# EAGLE schematic FlowController (EAGLE 9.6.2)
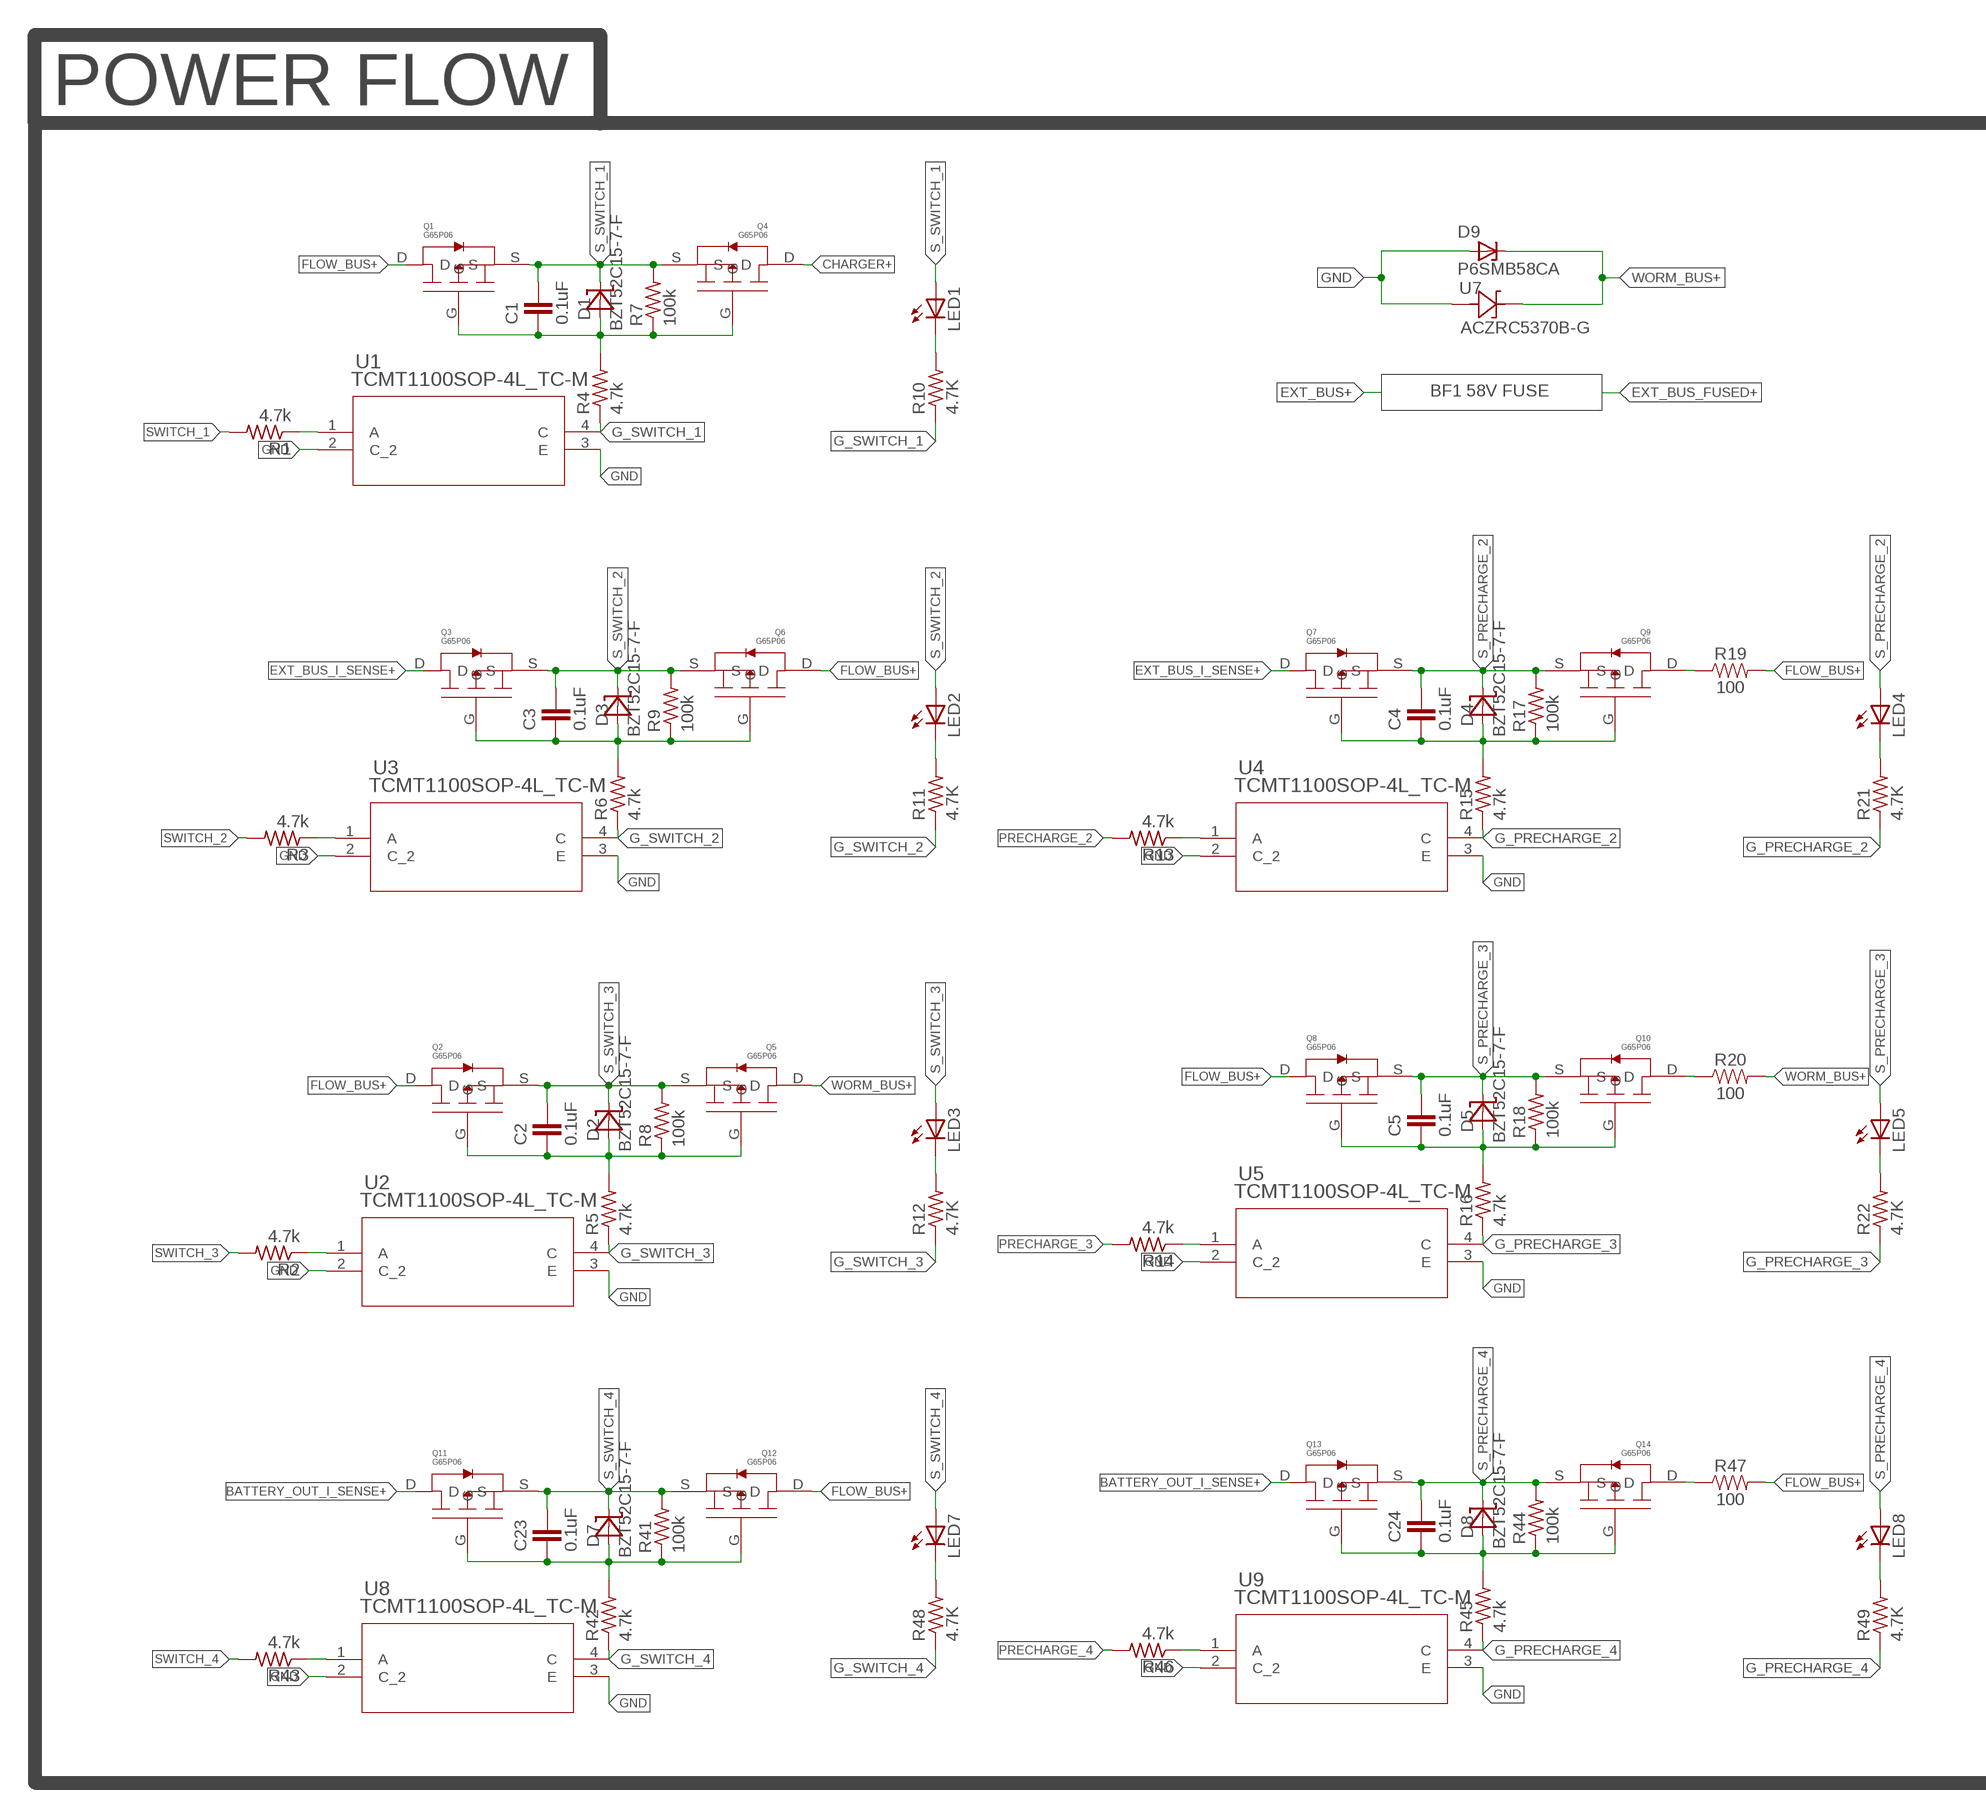
[diagram p0: schematic, sheet 1, part 1 of 2]
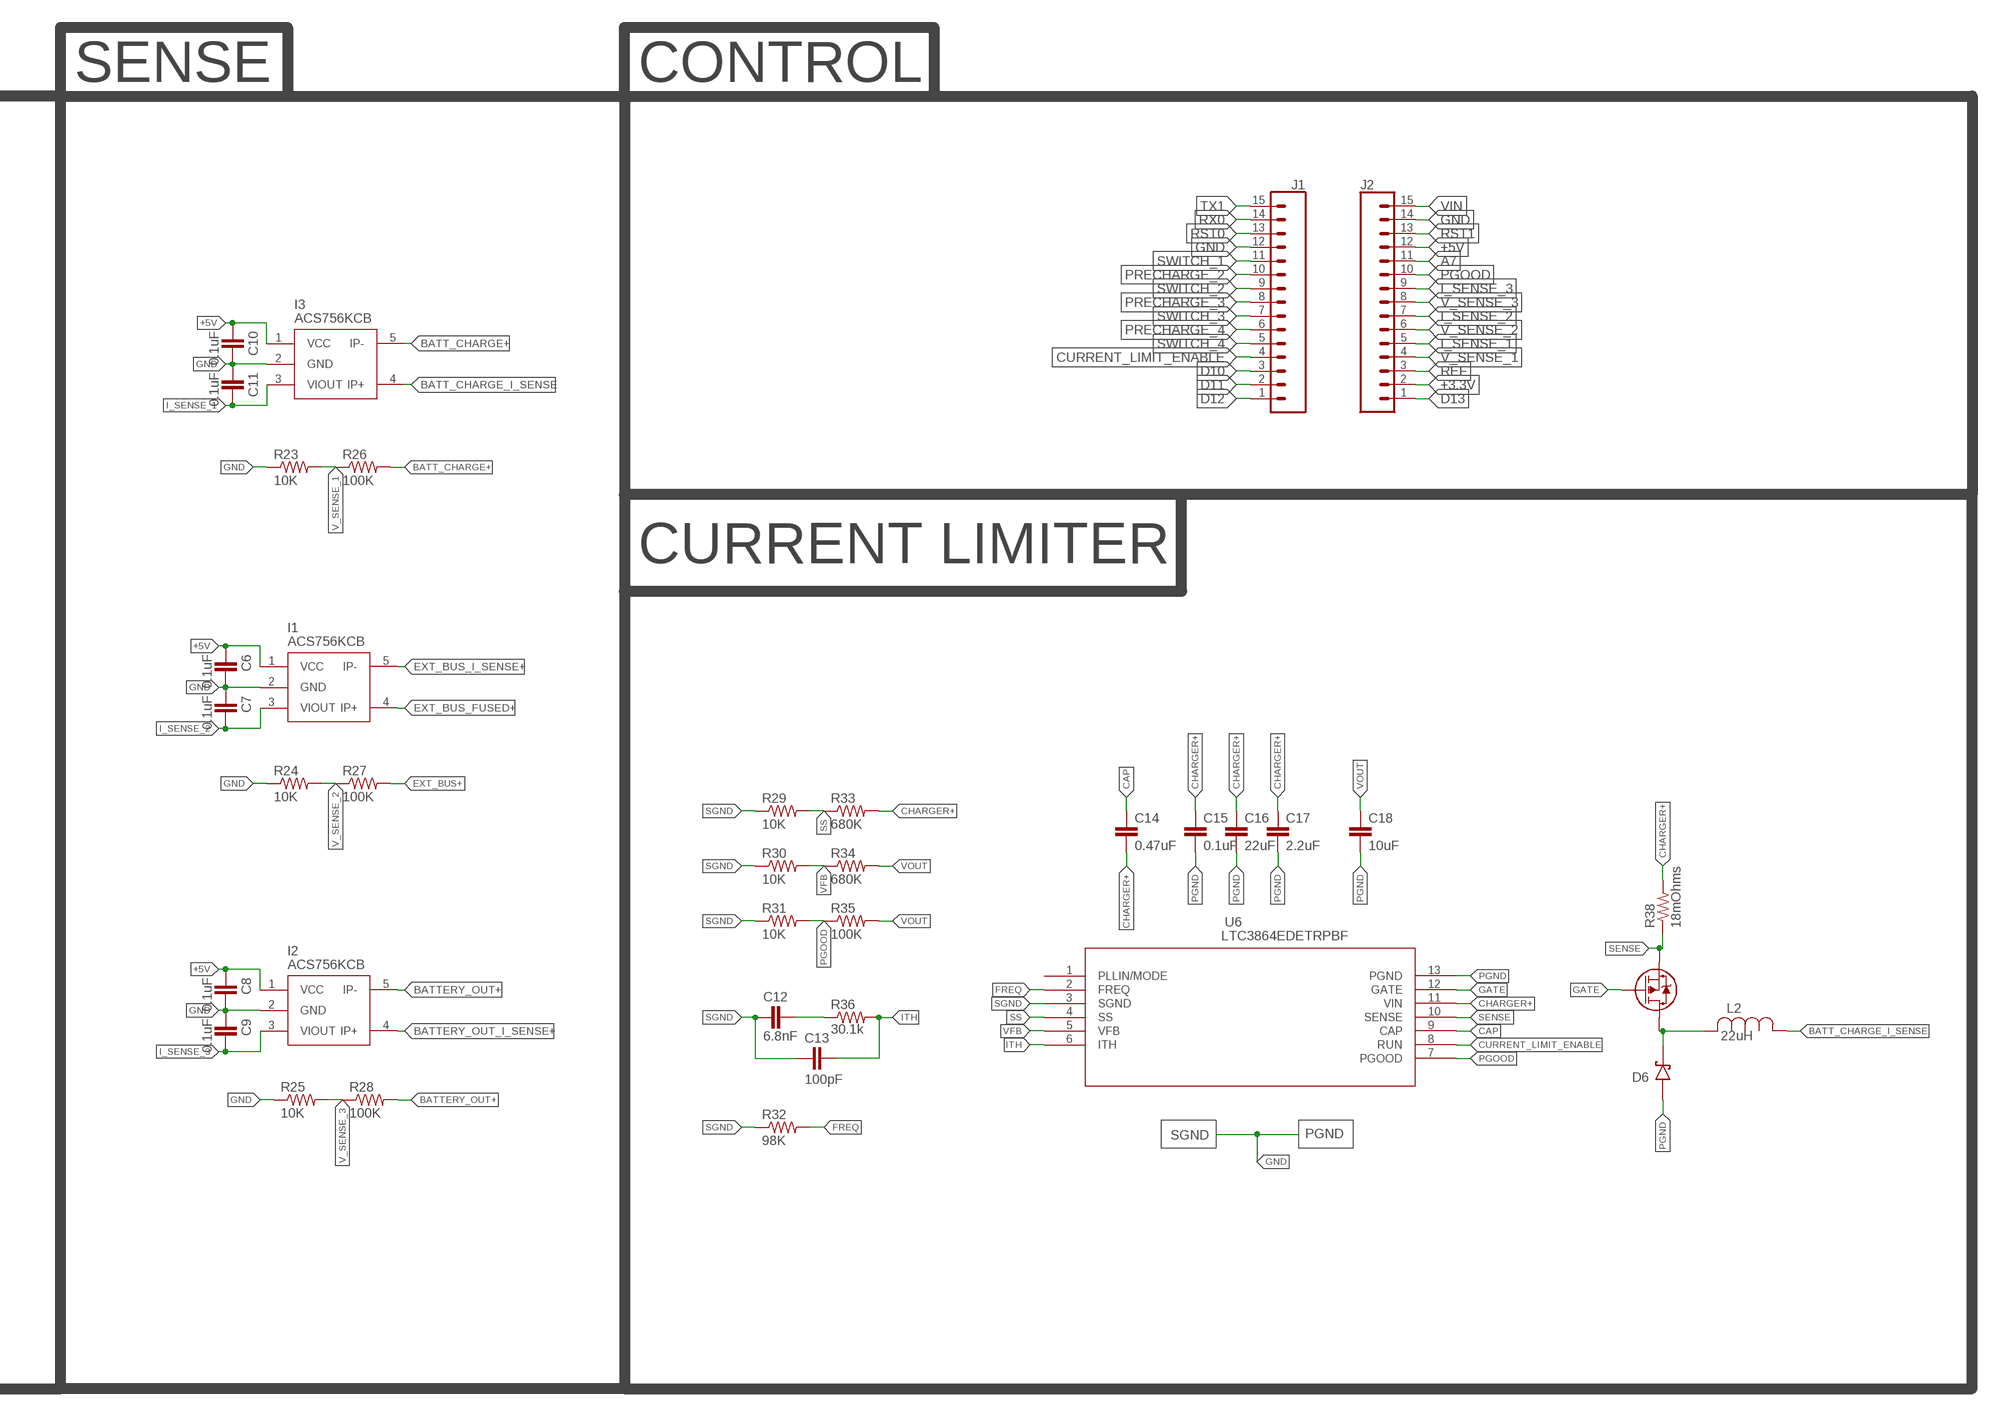
[diagram p1: schematic, sheet 1, part 2 of 2]

## Parts
C1  0.1uF  2.2UF-0805-25V-(+80/-20%)  [0805]
C2  0.1uF  2.2UF-0805-25V-(+80/-20%)  [0805]
C3  0.1uF  2.2UF-0805-25V-(+80/-20%)  [0805]
C4  0.1uF  2.2UF-0805-25V-(+80/-20%)  [0805]
C5  0.1uF  2.2UF-0805-25V-(+80/-20%)  [0805]
C6  0.1uF  2.2UF-0805-25V-(+80/-20%)  [0805]
C7  0.1uF  2.2UF-0805-25V-(+80/-20%)  [0805]
C8  0.1uF  2.2UF-0805-25V-(+80/-20%)  [0805]
C9  0.1uF  2.2UF-0805-25V-(+80/-20%)  [0805]
C10  0.1uF  2.2UF-0805-25V-(+80/-20%)  [0805]
C11  0.1uF  2.2UF-0805-25V-(+80/-20%)  [0805]
C12  6.8nF  2.2UF-0805-25V-(+80/-20%)  [0805]
C13  100pF  2.2UF-0805-25V-(+80/-20%)  [0805]
C14  0.47uF  2.2UF-0805-25V-(+80/-20%)  [0805]
C15  0.1uF  2.2UF-0805-25V-(+80/-20%)  [0805]
C16  22uF  10UF-1210-50V-20%  [1210]
C17  2.2uF  10UF-1210-50V-20%  [1210]
C18  10uF  10UF-1210-50V-20%  [1210]
C23  0.1uF  2.2UF-0805-25V-(+80/-20%)  [0805]
C24  0.1uF  2.2UF-0805-25V-(+80/-20%)  [0805]
D1  BZT52C15-7-F  [SOD123]
D2  BZT52C15-7-F  [SOD123]
D3  BZT52C15-7-F  [SOD123]
D4  BZT52C15-7-F  [SOD123]
D5  BZT52C15-7-F  [SOD123]
D6  MBR1560STR  [DIO_MBR1560STR]
D7  BZT52C15-7-F  [SOD123]
D8  BZT52C15-7-F  [SOD123]
D9  P6SMB58CA  1SMB5913BT3G  [DO214AA]
I1  ACS756KCB  [ACS756KCB]
I2  ACS756KCB  [ACS756KCB]
I3  ACS756KCB  [ACS756KCB]
J1  CONN_15  [1X15]
J2  CONN_15  [1X15]
L2  22uH  IHLP4040DZER6R8M01  [IND_IHLP-4040DZ_VIS]
LED1  LEDCHIPLED_0805  [CHIPLED_0805]
LED2  LEDCHIPLED_0805  [CHIPLED_0805]
LED3  LEDCHIPLED_0805  [CHIPLED_0805]
LED4  LEDCHIPLED_0805  [CHIPLED_0805]
LED5  LEDCHIPLED_0805  [CHIPLED_0805]
LED7  LEDCHIPLED_0805  [CHIPLED_0805]
LED8  LEDCHIPLED_0805  [CHIPLED_0805]
Q1  G65P06  [G65P06]
Q2  G65P06  [G65P06]
Q3  G65P06  [G65P06]
Q4  G65P06  [G65P06]
Q5  G65P06  [G65P06]
Q6  G65P06  [G65P06]
Q7  G65P06  [G65P06]
Q8  G65P06  [G65P06]
Q9  G65P06  [G65P06]
Q10  G65P06  [G65P06]
Q11  G65P06  [G65P06]
Q12  G65P06  [G65P06]
Q13  G65P06  [G65P06]
Q14  G65P06  [G65P06]
R1  4.7k  R-US_M0805  [M0805]
R2  4.7k  R-US_M0805  [M0805]
R3  4.7k  R-US_M0805  [M0805]
R4  4.7k  R-US_M0805  [M0805]
R5  4.7k  R-US_M0805  [M0805]
R6  4.7k  R-US_M0805  [M0805]
R7  100k  R-US_M0805  [M0805]
R8  100k  R-US_M0805  [M0805]
R9  100k  R-US_M0805  [M0805]
R10  4.7K  R-US_M0805  [M0805]
R11  4.7K  R-US_M0805  [M0805]
R12  4.7K  R-US_M0805  [M0805]
R13  4.7k  R-US_M0805  [M0805]
R14  4.7k  R-US_M0805  [M0805]
R15  4.7k  R-US_M0805  [M0805]
R16  4.7k  R-US_M0805  [M0805]
R17  100k  R-US_M0805  [M0805]
R18  100k  R-US_M0805  [M0805]
R19  100  0.05OHM-2512-3W-1%  [2512]
R20  100  0.05OHM-2512-3W-1%  [2512]
R21  4.7K  R-US_M0805  [M0805]
R22  4.7K  R-US_M0805  [M0805]
R23  10K  R-US_M0805  [M0805]
R24  10K  R-US_M0805  [M0805]
R25  10K  R-US_M0805  [M0805]
R26  100K  R-US_M0805  [M0805]
R27  100K  R-US_M0805  [M0805]
R28  100K  R-US_M0805  [M0805]
R29  10K  R-US_M0805  [M0805]
R30  10K  R-US_M0805  [M0805]
R31  10K  R-US_M0805  [M0805]
R32  98K  R-US_M0805  [M0805]
R33  680K  R-US_M0805  [M0805]
R34  680K  R-US_M0805  [M0805]
R35  100K  R-US_M0805  [M0805]
R36  30.1k  R-US_M0805  [M0805]
R37  RSJ250P10TL  [TRANS_R5009FNJ_ROM]
R38  18mOhms  R-US_M0805  [M0805]
R41  100k  R-US_M0805  [M0805]
R42  4.7k  R-US_M0805  [M0805]
R43  4.7k  R-US_M0805  [M0805]
R44  100k  R-US_M0805  [M0805]
R45  4.7k  R-US_M0805  [M0805]
R46  4.7k  R-US_M0805  [M0805]
R47  100  0.05OHM-2512-3W-1%  [2512]
R48  4.7K  R-US_M0805  [M0805]
R49  4.7K  R-US_M0805  [M0805]
U1  TCMT1100SOP-4L_TC-M  [SOP-4L_TC-M]
U2  TCMT1100SOP-4L_TC-M  [SOP-4L_TC-M]
U3  TCMT1100SOP-4L_TC-M  [SOP-4L_TC-M]
U4  TCMT1100SOP-4L_TC-M  [SOP-4L_TC-M]
U5  TCMT1100SOP-4L_TC-M  [SOP-4L_TC-M]
U6  LTC3864EDETRPBF  [DFN-12_DE]
U7  ACZRC5370B-G  [ACZRC-G]
U8  TCMT1100SOP-4L_TC-M  [SOP-4L_TC-M]
U9  TCMT1100SOP-4L_TC-M  [SOP-4L_TC-M]

## Nets
+3.3V: J2.2
+5V: C6.1 C8.1 C10.1 I1.1(VCC) I2.1(VCC) I3.1(VCC) J2.12
A7: J2.11
BATT_CHARGE+: I3.5(IP-) R26.2
BATT_CHARGE_I_SENSE: I3.4(IP+) L2.1
BATTERY_OUT+: I2.5(IP-) R28.2
BATTERY_OUT_I_SENSE+: I2.4(IP+) Q11.D Q13.D
CAP: C14.1 U6.9(CAP)
CHARGER+: C14.2 C15.1 C16.1 C17.1 Q4.D R33.2 R38.2 U6.11(VIN)
CURRENT_LIMIT_ENABLE: J1.4 U6.8(RUN)
D10: J1.3
D11: J1.2
D12: J1.1
D13: J2.1
EXT_BUS+: R27.2
EXT_BUS_FUSED+: I1.4(IP+)
EXT_BUS_I_SENSE+: I1.5(IP-) Q3.D Q7.D
FLOW_BUS+: Q1.D Q2.D Q6.D Q8.D Q12.D R19.P$2 R47.P$2
FREQ: R32.2 U6.2(FREQ)
G_PRECHARGE_2: R15.1 R21.1 U4.4(C)
G_PRECHARGE_3: R16.1 R22.1 U5.4(C)
G_PRECHARGE_4: R45.1 R49.1 U9.4(C)
G_SWITCH_1: R4.1 R10.1 U1.4(C)
G_SWITCH_2: R6.1 R11.1 U3.4(C)
G_SWITCH_3: R5.1 R12.1 U2.4(C)
G_SWITCH_4: R42.1 R48.1 U8.4(C)
GATE: R37.1 U6.12(GATE)
GND: C6.2 C7.1 C8.2 C9.1 C10.2 C11.1 D9.A I1.2(GND) I2.2(GND) I3.2(GND) J1.12 J2.14 R23.1 R24.1 R25.1 U1.2(C_2) U1.3(E) U2.2(C_2) U2.3(E) U3.2(C_2) U3.3(E) U4.2(C_2) U4.3(E) U5.2(C_2) U5.3(E) U7.2 U8.2(C_2) U8.3(E) U9.2(C_2) U9.3(E)
I_SENSE_1: C11.2 I3.3(VIOUT) J2.5
I_SENSE_2: C7.2 I1.3(VIOUT) J2.7
I_SENSE_3: C9.2 I2.3(VIOUT) J2.9
ITH: C13.2 R36.2 U6.6(ITH)
N$1: LED2.C R11.2
N$2: LED1.C R10.2
N$3: LED3.C R12.2
N$4: LED4.C R21.2
N$5: C1.1 D1.A Q1.G Q4.G R4.2 R7.1
N$6: LED5.C R22.2
N$7: C23.1 D7.A Q11.G Q12.G R41.1 R42.2
N$9: R43.1 U8.1(A)
N$10: C24.1 D8.A Q13.G Q14.G R44.1 R45.2
N$11: R1.1 U1.1(A)
N$12: R46.1 U9.1(A)
N$13: Q14.D R47.P$1
N$14: C4.1 D4.A Q7.G Q9.G R15.2 R17.1
N$15: LED7.C R48.2
N$16: C3.1 D3.A Q3.G Q6.G R6.2 R9.1
N$17: LED8.C R49.2
N$18: R3.1 U3.1(A)
N$20: C2.1 D2.A Q2.G Q5.G R5.2 R8.1
N$22: R2.1 U2.1(A)
N$23: C12.2 R36.1
N$24: D6.3(K) D6.4(K) L2.2 R37.2
N$26: R13.1 U4.1(A)
N$28: C5.1 D5.A Q8.G Q10.G R16.2 R18.1
N$30: R14.1 U5.1(A)
N$33: Q9.D R19.P$1
N$34: Q10.D R20.P$1
PGND: C15.2 C16.2 C17.2 C18.2 D6.1(A) D6.2(A) U6.13(PGND)
PGOOD: J2.10 R31.2 R35.1 U6.7(PGOOD)
PRECHARGE_2: J1.10 R13.2
PRECHARGE_3: J1.8 R14.2
PRECHARGE_4: J1.6 R46.2
REF: J2.3
RST0: J1.13
RST1: J2.13
RX0: J1.14
S_PRECHARGE_2: C4.2 D4.C LED4.A Q7.S Q9.S R17.2
S_PRECHARGE_3: C5.2 D5.C LED5.A Q8.S Q10.S R18.2
S_PRECHARGE_4: C24.2 D8.C LED8.A Q13.S Q14.S R44.2
S_SWITCH_1: C1.2 D1.C LED1.A Q1.S Q4.S R7.2
S_SWITCH_2: C3.2 D3.C LED2.A Q3.S Q6.S R9.2
S_SWITCH_3: C2.2 D2.C LED3.A Q2.S Q5.S R8.2
S_SWITCH_4: C23.2 D7.C LED7.A Q11.S Q12.S R41.2
SENSE: R37.3 R38.1 U6.10(SENSE)
SGND: C12.1 C13.1 R29.1 R30.1 R31.1 R32.1 U6.3(SGND)
SS: R29.2 R33.1 U6.4(SS)
SWITCH_1: J1.11 R1.2
SWITCH_2: J1.9 R3.2
SWITCH_3: J1.7 R2.2
SWITCH_4: J1.5 R43.2
TX1: J1.15
V_SENSE_1: J2.4 R23.2 R26.1
V_SENSE_2: J2.6 R24.2 R27.1
V_SENSE_3: J2.8 R25.2 R28.1
VFB: R30.2 R34.1 U6.5(VFB)
VIN: J2.15
VOUT: C18.1 R34.2 R35.2
WORM_BUS+: D9.C Q5.D R20.P$2 U7.1
Unconnected: U6.1(PLLIN/MODE)

## Notes on the sheet
- POWER FLOW | SENSE | CONTROL
- BF1 58V FUSE
- CURRENT LIMITER
- SGND
- PGND

## Library data of the parts
C1-C15 C23 C24 = SparkFun-Capacitors:2.2UF: 2.2µF ceramic capacitors A capacitor is a passive two-terminal electrical component used to store electrical energy temporarily in an electric field.; PROD_ID: CAP-11624; VALUE: 2.2uF
C16 C17 = SparkFun-Capacitors:10UF: 10.0µF ceramic capacitors A capacitor is a passive two-terminal electrical component used to store electrical energy temporarily in an electric field.; PROD_ID: CAP-09824; VALUE: 10uF
C18 = SparkFun-Capacitors:10UF: 10.0µF ceramic capacitors A capacitor is a passive two-terminal electrical component used to store electrical energy temporarily in an electric field.; PROD_ID: CAP-09824
D1-D5 D7 D8 = BZT52C15-7-F:BZT52C15-7-F: Diodes Inc. BZT52C15-7-F 15V Zener diode • Planar Die Construction • 500mW Power Dissipation • General Purpose, Medium Current • Ideally Suited for Automated Assembly Processes • Totally Lead-Free & Fully RoHS Compliant (Notes 1 & 2) • Halogen and Antimony Free. “Green” Device (Notes 3 & 4) • Qualified to AEC-Q101 Standards for High Reliability • Case: SOD123 • Case Material: Molded Plastic. UL Flammability Classification Rating 94V-0 • Moisture Sensitivity: Level 1 per J-STD-020 • Terminals: Matte Tin Finish annealed over Alloy 42 leadframe (Lead Free Plating). Solderable per MIL-STD-202, Method 208 • Polarity: Cathode Band • Weight: 0.010 grams (approximate); DESCRIPTION: Zener Diode 15 V 500 mW ±6% Surface Mount SOD-123; DIGI-KEY_PART_NUMBER: BZT52C15-FDITR-ND; MF: Diodes Inc.; MP: BZT52C15-7-F; PACKAGE: SOD-123 Fairchild Semiconductor; PURCHASE-URL: https://pricing.snapeda.com/search/part/BZT52C15-7-F/?ref=eda
D6 = MBR1560STR:MBR1560STR: Diode Schottky 60V 15A Surface Mount TO-277B; DESCRIPTION: Diode Schottky 60 V 15A Surface Mount TO-277B; MF: SMC Diode Solutions; MP: MBR1560STR; PACKAGE: TO-277 SMC Diode Solutions; PURCHASE-URL: https://pricing.snapeda.com/search/part/MBR1560STR/?ref=eda
D9 = 1smb59xx_10:1SMB59*BT3G: 1SMB59xxBT3G Series 3 Watt Plastic Surface Mount Zener Voltage Regulators Source: http://www.onsemi.com/pub_link/Collateral/1SMB5913BT3-D.PDF; MF: ON Semiconductor; MPN: 1SMB5913BT3G; OC_FARNELL: 1431155; OC_NEWARK: 88H5165
I1-I3 = FlowControllerLib:ACS756KCB
J1 = SparkFun-Connectors:CONN_15: Multi connection point. Often used as Generic Header-pin footprint for 0.1 inch spaced/style header connections On any of the 0.1 inch spaced packages, you can populate with these: Break Away Headers - Straight <https://www.sparkfun.com/products/116> (PRT-00116) Break Away Male Headers - Right Angle <https://www.sparkfun.com/products/553> (PRT-00553) Female Headers <https://www.sparkfun.com/products/115> (PRT-00115) Break Away Headers - Machine Pin <https://www.sparkfun.com/products/117> (PRT-00117) Break Away Female Headers - Swiss Machine Pin <https://www.sparkfun.com/products/743> (PRT-00743) For SCREWTERMINALS and SPRING TERMINALS visit here: Screw Terimnals on SparkFun.com <https://www.sparkfun.com/search/results?term=Screw+Terminals> (5mm/3.5mm/2.54mm spacing) This device is also useful as a general connection point to wire up your design to another part of your project. Our various solder wires solder well into these plated through hole pads. Hook-Up Wire - Assortment (Stranded, 22 AWG) <https://www.sparkfun.com/products/11375> (PRT-11375) Hook-Up Wire - Assortment (Solid Core, 22 AWG) <https://www.sparkfun.com/products/11367> (PRT-11367) View the entire wire category on our website here <https://www.sparkfun.com/categories/141> Special notes: Molex polarized connector foot print use with SKU : PRT-08231 with associated crimp pins and housings. 1MM SMD Version SKU: PRT-10208 NOTES ON THE VARIANTS LOCK and LOCK_LONGPADS... This footprint was designed to help hold the alignment of a through-hole component (i.e. 6-pin header) while soldering it into place. You may notice that each hole has been shifted either up or down by 0.005 of an inch from it's more standard position (which is a perfectly straight line). This slight alteration caused the pins (the squares in the middle) to touch the edges of the holes. Because they are alternating, it causes a "brace" to hold the component in place. 0.005 has proven to be the perfect amount of "off-center" position when using our standard breakaway headers. Although looks a little odd when you look at the bare footprint, once you have a header in there, the alteration is very hard to notice. Also,if you push a header all the way into place, it is covered up entirely on the bottom side.
J2 = SparkFun-Connectors:CONN_15: Multi connection point. Often used as Generic Header-pin footprint for 0.1 inch spaced/style header connections On any of the 0.1 inch spaced packages, you can populate with these: Break Away Headers - Straight <https://www.sparkfun.com/products/116> (PRT-00116) Break Away Male Headers - Right Angle <https://www.sparkfun.com/products/553> (PRT-00553) Female Headers <https://www.sparkfun.com/products/115> (PRT-00115) Break Away Headers - Machine Pin <https://www.sparkfun.com/products/117> (PRT-00117) Break Away Female Headers - Swiss Machine Pin <https://www.sparkfun.com/products/743> (PRT-00743) For SCREWTERMINALS and SPRING TERMINALS visit here: Screw Terimnals on SparkFun.com <https://www.sparkfun.com/search/results?term=Screw+Terminals> (5mm/3.5mm/2.54mm spacing) This device is also useful as a general connection point to wire up your design to another part of your project. Our various solder wires solder well into these plated through hole pads. Hook-Up Wire - Assortment (Stranded, 22 AWG) <https://www.sparkfun.com/products/11375> (PRT-11375) Hook-Up Wire - Assortment (Solid Core, 22 AWG) <https://www.sparkfun.com/products/11367> (PRT-11367) View the entire wire category on our website here <https://www.sparkfun.com/categories/141> Special notes: Molex polarized connector foot print use with SKU : PRT-08231 with associated crimp pins and housings. 1MM SMD Version SKU: PRT-10208 NOTES ON THE VARIANTS LOCK and LOCK_LONGPADS... This footprint was designed to help hold the alignment of a through-hole component (i.e. 6-pin header) while soldering it into place. You may notice that each hole has been shifted either up or down by 0.005 of an inch from it's more standard position (which is a perfectly straight line). This slight alteration caused the pins (the squares in the middle) to touch the edges of the holes. Because they are alternating, it causes a "brace" to hold the component in place. 0.005 has proven to be the perfect amount of "off-center" position when using our standard breakaway headers. Although looks a little odd when you look at the bare footprint, once you have a header in there, the alteration is very hard to notice. Also,if you push a header all the way into place, it is covered up entirely on the bottom side.; SPICEPREFIX: X
L2 = CurrentLimiter:IHLP4040DZER6R8M01; COPYRIGHT: Copyright (C) 2022 Ultra Librarian. All rights reserved.; DIGI-KEY_PART_NUMBER_1: 541-1303-1-ND; DIGI-KEY_PART_NUMBER_2: 541-1303-2-ND; DIGI-KEY_PART_NUMBER_3: 541-1303-6-ND; MANUFACTURER_PART_NUMBER: IHLP4040DZER6R8M01; MFR_NAME: Vishay
LED1-LED5 LED7 LED8 = adafruit:LED: LED OSRAM: - CHIPLED LG R971, LG N971, LY N971, LG Q971, LY Q971, LO R971, LY R971 LH N974, LH R974 LS Q976, LO Q976, LY Q976 LO Q996 - Hyper CHIPLED LW Q18S LB Q993, LB Q99A, LB R99A - SideLED LS A670, LO A670, LY A670, LG A670, LP A670 LB A673, LV A673, LT A673, LW A673 LH A674 LY A675 LS A676, LA A676, LO A676, LY A676, LW A676 LS A679, LY A679, LG A679 - Hyper Micro SIDELED® LS Y876, LA Y876, LO Y876, LY Y876 LT Y87S - SmartLED LW L88C, LW L88S LB L89C, LB L89S, LG L890 LS L89K, LO L89K, LY L89K LS L896, LA L896, LO L896, LY L896 - TOPLED LS T670, LO T670, LY T670, LG T670, LP T670 LSG T670, LSP T670, LSY T670, LOP T670, LYG T670 LG T671, LOG T671, LSG T671 LB T673, LV T673, LT T673, LW T673 LH T674 LS T676, LA T676, LO T676, LY T676, LB T676, LH T676, LSB T676, LW T676 LB T67C, LV T67C, LT T67C, LS T67K, LO T67K, LY T67K, LW E67C LS E67B, LA E67B, LO E67B, LY E67B, LB E67C, LV E67C, LT E67C LW T67C LS T679, LY T679, LG T679 LS T770, LO T770, LY T770, LG T770, LP T770 LB T773, LV T773, LT T773, LW T773 LH T774 LS E675, LA E675, LY E675, LS T675 LS T776, LA T776, LO T776, LY T776, LB T776 LHGB T686 LT T68C, LB T68C - Hyper Mini TOPLED® LB M676 - Mini TOPLED Santana® LG M470 LS M47K, LO M47K, LY M47K Source: http://www.osram.convergy.de/
Q1-Q14 = FlowControllerLib:G65P06
R1-R18 R21-R36 R38 R41-R46 R48 R49 = adafruit:R-US_: RESISTOR, American symbol
R19 R20 R47 = SparkFun-Resistors:0.05OHM: 0.05Ω resistor A resistor is a passive two-terminal electrical component that implements electrical resistance as a circuit element. Resistors act to reduce current flow, and, at the same time, act to lower voltage levels within circuits. - Wikipedia; PROD_ID: RES-13771; VALUE: 0.05
R37 = CurrentLimiter:RSJ250P10TL; COPYRIGHT: Copyright (C) 2022 Ultra Librarian. All rights reserved.; DIGI-KEY_PART_NUMBER_1: RSJ250P10TLCT-ND; DIGI-KEY_PART_NUMBER_2: RSJ250P10TLDKR-ND; DIGI-KEY_PART_NUMBER_3: RSJ250P10TLTR-ND; MANUFACTURER_PART_NUMBER: RSJ250P10TL; MFR_NAME: ROHM Semiconductor
U1-U5 U8 U9 = FlowControllerLib:TCMT1100; COPYRIGHT: Copyright (C) 2022 Ultra Librarian. All rights reserved.; DIGI-KEY_PART_NUMBER_1: TCMT1100CT-ND; DIGI-KEY_PART_NUMBER_2: TCMT1100DKR-ND; DIGI-KEY_PART_NUMBER_3: TCMT1100TR-ND; MANUFACTURER_PART_NUMBER: TCMT1100; MFR_NAME: Vishay
U6 = LTC3864EDETRPBF:LTC3864EDETRPBF; DESCRIPTION: Buck Regulator Positive Output Step-Down - DC-DC Controller IC 12-DFN (4x3); DIGI-KEY_PART_NUMBER: 161-LTC3864EDE#TRPBFTR-ND; MF: Analog Devices; MP: LTC3864EDE#TRPBF; PACKAGE: DFN -12 Analog Devices; PURCHASE-URL: https://pricing.snapeda.com/search/part/LTC3864EDE#TRPBF/?ref=eda
U7 = FlowControllerLib:ACZRC5370B-G; COPYRIGHT: Copyright (C) 2022 Ultra Librarian. All rights reserved.; DIGI-KEY_PART_NUMBER_1: 641-1916-1-ND; DIGI-KEY_PART_NUMBER_2: 641-1916-2-ND; DIGI-KEY_PART_NUMBER_3: 641-1916-6-ND; DIGI-KEY_PART_NUMBER_4: ACZRC5370B-G-ND; MANUFACTURER_PART_NUMBER: ACZRC5370B-G; MFR_NAME: Comchip